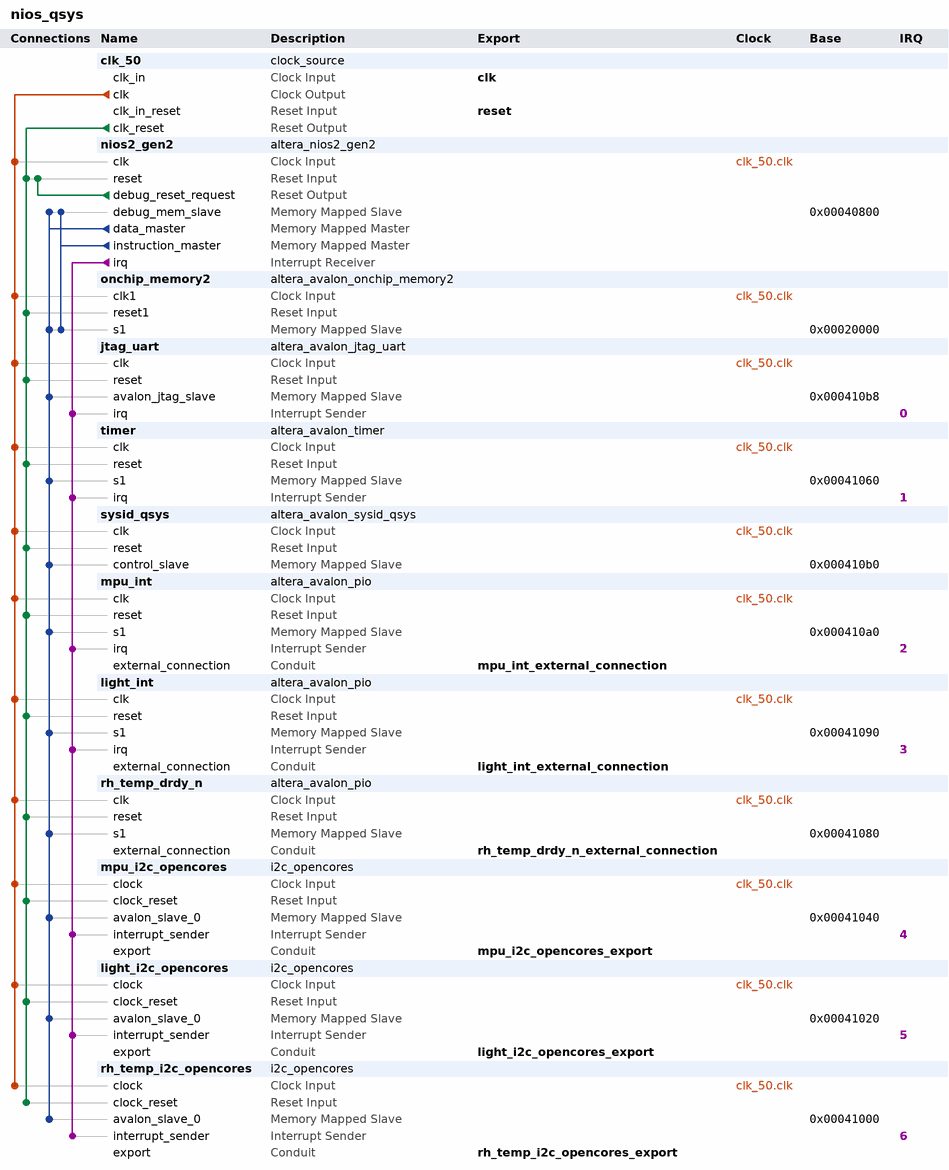
[diagram p0: system contents]
# Platform Designer (Qsys) system nios_qsys, Cyclone V 5CSEBA6U23I7
# Parameters at their usual value, and those the tool derives, are not listed.
package require -exact qsys 17.0
create_system nios_qsys
set_project_property DEVICE_FAMILY {Cyclone V}
set_project_property DEVICE 5CSEBA6U23I7

add_instance clk_50 clock_source 17.0
set_instance_parameter_value clk_50 clockFrequency 50000000

add_instance nios2_gen2 altera_nios2_gen2 17.0
set_instance_parameter_value nios2_gen2 dcache_size 2048
set_instance_parameter_value nios2_gen2 exceptionSlave onchip_memory2.s1
set_instance_parameter_value nios2_gen2 icache_size 4096
set_instance_parameter_value nios2_gen2 impl Fast
set_instance_parameter_value nios2_gen2 resetSlave onchip_memory2.s1

add_instance onchip_memory2 altera_avalon_onchip_memory2 17.0
set_instance_parameter_value onchip_memory2 dataWidth 32
set_instance_parameter_value onchip_memory2 dualPort false
set_instance_parameter_value onchip_memory2 initMemContent false
set_instance_parameter_value onchip_memory2 initializationFileName onchip_mem.hex
set_instance_parameter_value onchip_memory2 memorySize 128000

add_instance jtag_uart altera_avalon_jtag_uart 17.0
set_instance_parameter_value jtag_uart simInteractiveOptions NO_INTERACTIVE_WINDOWS

add_instance timer altera_avalon_timer 17.0
set_instance_parameter_value timer period 1
set_instance_parameter_value timer periodUnits MSEC

add_instance sysid_qsys altera_avalon_sysid_qsys 17.0
set_instance_parameter_value sysid_qsys id 0

add_instance mpu_int altera_avalon_pio 17.0
set_instance_parameter_value mpu_int captureEdge true
set_instance_parameter_value mpu_int direction Input
set_instance_parameter_value mpu_int edgeType FALLING
set_instance_parameter_value mpu_int generateIRQ true
set_instance_parameter_value mpu_int irqType EDGE
set_instance_parameter_value mpu_int width 1

add_instance light_int altera_avalon_pio 17.0
set_instance_parameter_value light_int captureEdge true
set_instance_parameter_value light_int direction Input
set_instance_parameter_value light_int edgeType FALLING
set_instance_parameter_value light_int generateIRQ true
set_instance_parameter_value light_int irqType EDGE
set_instance_parameter_value light_int width 1

add_instance rh_temp_drdy_n altera_avalon_pio 17.0
set_instance_parameter_value rh_temp_drdy_n direction Input
set_instance_parameter_value rh_temp_drdy_n width 1

add_instance mpu_i2c_opencores i2c_opencores 12.0

add_instance light_i2c_opencores i2c_opencores 12.0

add_instance rh_temp_i2c_opencores i2c_opencores 12.0

# connections
add_connection clk_50.clk jtag_uart.clk clock
add_connection clk_50.clk light_i2c_opencores.clock clock
add_connection clk_50.clk light_int.clk clock
add_connection clk_50.clk mpu_i2c_opencores.clock clock
add_connection clk_50.clk mpu_int.clk clock
add_connection clk_50.clk nios2_gen2.clk clock
add_connection clk_50.clk onchip_memory2.clk1 clock
add_connection clk_50.clk rh_temp_drdy_n.clk clock
add_connection clk_50.clk rh_temp_i2c_opencores.clock clock
add_connection clk_50.clk sysid_qsys.clk clock
add_connection clk_50.clk timer.clk clock
add_connection clk_50.clk_reset jtag_uart.reset reset
add_connection clk_50.clk_reset light_i2c_opencores.clock_reset reset
add_connection clk_50.clk_reset light_int.reset reset
add_connection clk_50.clk_reset mpu_i2c_opencores.clock_reset reset
add_connection clk_50.clk_reset mpu_int.reset reset
add_connection clk_50.clk_reset nios2_gen2.reset reset
add_connection clk_50.clk_reset onchip_memory2.reset1 reset
add_connection clk_50.clk_reset rh_temp_drdy_n.reset reset
add_connection clk_50.clk_reset rh_temp_i2c_opencores.clock_reset reset
add_connection clk_50.clk_reset sysid_qsys.reset reset
add_connection clk_50.clk_reset timer.reset reset
add_connection nios2_gen2.debug_reset_request nios2_gen2.reset reset
add_connection nios2_gen2.data_master jtag_uart.avalon_jtag_slave avalon
set_connection_parameter_value nios2_gen2.data_master/jtag_uart.avalon_jtag_slave baseAddress 0x000410b8
add_connection nios2_gen2.data_master light_i2c_opencores.avalon_slave_0 avalon
set_connection_parameter_value nios2_gen2.data_master/light_i2c_opencores.avalon_slave_0 baseAddress 0x00041020
add_connection nios2_gen2.data_master light_int.s1 avalon
set_connection_parameter_value nios2_gen2.data_master/light_int.s1 baseAddress 0x00041090
add_connection nios2_gen2.data_master mpu_i2c_opencores.avalon_slave_0 avalon
set_connection_parameter_value nios2_gen2.data_master/mpu_i2c_opencores.avalon_slave_0 baseAddress 0x00041040
add_connection nios2_gen2.data_master mpu_int.s1 avalon
set_connection_parameter_value nios2_gen2.data_master/mpu_int.s1 baseAddress 0x000410a0
add_connection nios2_gen2.data_master nios2_gen2.debug_mem_slave avalon
set_connection_parameter_value nios2_gen2.data_master/nios2_gen2.debug_mem_slave baseAddress 0x00040800
add_connection nios2_gen2.data_master onchip_memory2.s1 avalon
set_connection_parameter_value nios2_gen2.data_master/onchip_memory2.s1 baseAddress 0x00020000
add_connection nios2_gen2.data_master rh_temp_drdy_n.s1 avalon
set_connection_parameter_value nios2_gen2.data_master/rh_temp_drdy_n.s1 baseAddress 0x00041080
add_connection nios2_gen2.data_master rh_temp_i2c_opencores.avalon_slave_0 avalon
set_connection_parameter_value nios2_gen2.data_master/rh_temp_i2c_opencores.avalon_slave_0 baseAddress 0x00041000
add_connection nios2_gen2.data_master sysid_qsys.control_slave avalon
set_connection_parameter_value nios2_gen2.data_master/sysid_qsys.control_slave baseAddress 0x000410b0
add_connection nios2_gen2.data_master timer.s1 avalon
set_connection_parameter_value nios2_gen2.data_master/timer.s1 baseAddress 0x00041060
add_connection nios2_gen2.instruction_master nios2_gen2.debug_mem_slave avalon
set_connection_parameter_value nios2_gen2.instruction_master/nios2_gen2.debug_mem_slave baseAddress 0x00040800
add_connection nios2_gen2.instruction_master onchip_memory2.s1 avalon
set_connection_parameter_value nios2_gen2.instruction_master/onchip_memory2.s1 baseAddress 0x00020000
add_connection nios2_gen2.irq jtag_uart.irq interrupt
set_connection_parameter_value nios2_gen2.irq/jtag_uart.irq irqNumber 0
add_connection nios2_gen2.irq light_i2c_opencores.interrupt_sender interrupt
set_connection_parameter_value nios2_gen2.irq/light_i2c_opencores.interrupt_sender irqNumber 5
add_connection nios2_gen2.irq light_int.irq interrupt
set_connection_parameter_value nios2_gen2.irq/light_int.irq irqNumber 3
add_connection nios2_gen2.irq mpu_i2c_opencores.interrupt_sender interrupt
set_connection_parameter_value nios2_gen2.irq/mpu_i2c_opencores.interrupt_sender irqNumber 4
add_connection nios2_gen2.irq mpu_int.irq interrupt
set_connection_parameter_value nios2_gen2.irq/mpu_int.irq irqNumber 2
add_connection nios2_gen2.irq rh_temp_i2c_opencores.interrupt_sender interrupt
set_connection_parameter_value nios2_gen2.irq/rh_temp_i2c_opencores.interrupt_sender irqNumber 6
add_connection nios2_gen2.irq timer.irq interrupt
set_connection_parameter_value nios2_gen2.irq/timer.irq irqNumber 1

# exported interfaces
add_interface clk clock sink
set_interface_property clk EXPORT_OF clk_50.clk_in
add_interface light_i2c_opencores_export conduit end
set_interface_property light_i2c_opencores_export EXPORT_OF light_i2c_opencores.export
add_interface light_int_external_connection conduit end
set_interface_property light_int_external_connection EXPORT_OF light_int.external_connection
add_interface mpu_i2c_opencores_export conduit end
set_interface_property mpu_i2c_opencores_export EXPORT_OF mpu_i2c_opencores.export
add_interface mpu_int_external_connection conduit end
set_interface_property mpu_int_external_connection EXPORT_OF mpu_int.external_connection
add_interface reset reset sink
set_interface_property reset EXPORT_OF clk_50.clk_in_reset
add_interface rh_temp_drdy_n_external_connection conduit end
set_interface_property rh_temp_drdy_n_external_connection EXPORT_OF rh_temp_drdy_n.external_connection
add_interface rh_temp_i2c_opencores_export conduit end
set_interface_property rh_temp_i2c_opencores_export EXPORT_OF rh_temp_i2c_opencores.export

set_interconnect_requirement {$system} qsys_mm.clockCrossingAdapter HANDSHAKE
set_interconnect_requirement {$system} qsys_mm.enableEccProtection FALSE
set_interconnect_requirement {$system} qsys_mm.insertDefaultSlave FALSE
set_interconnect_requirement {$system} qsys_mm.maxAdditionalLatency 1

save_system nios_qsys.qsys
